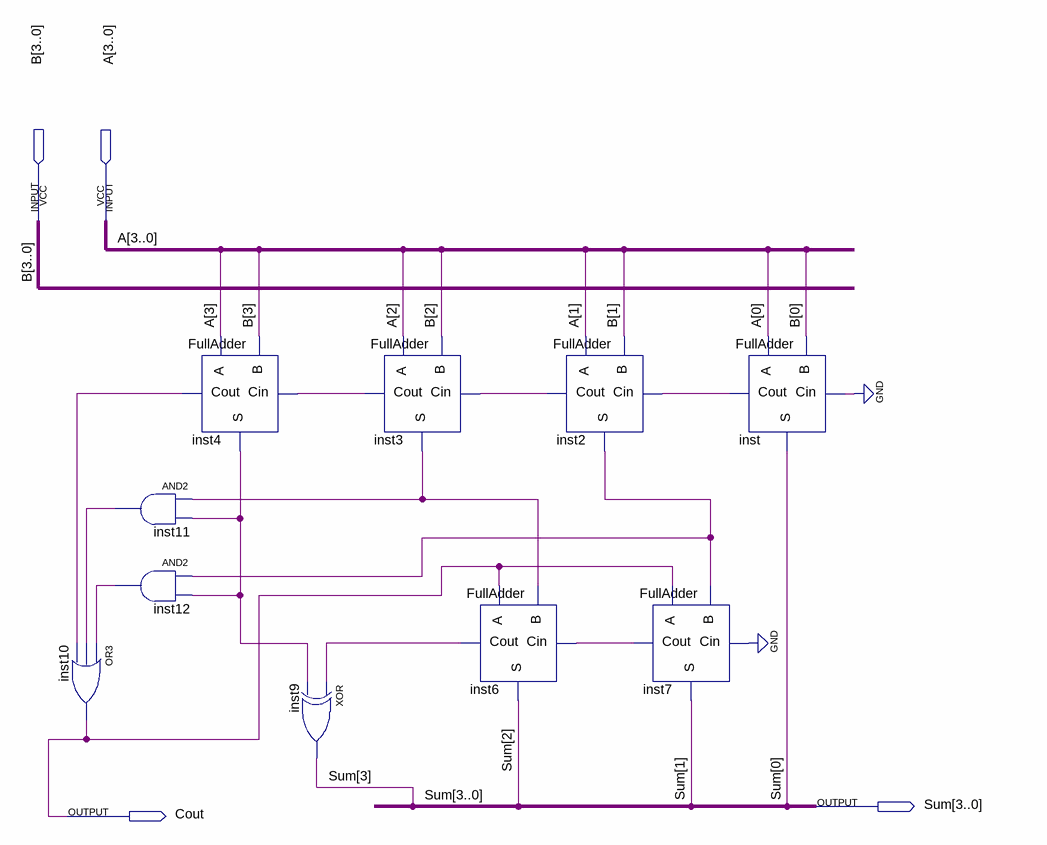
[diagram p0: schematic sheet]
// Quartus schematic BCD.bdf as structural Verilog: 10 symbols, 4 pins
module BCD (
  input  [3:0] B,
  input  [3:0] A,
  output [3:0] Sum,
  output Cout
);

  wire inst2_cout, inst2_s, inst3_cout, inst3_s, inst4_cout, inst4_s, inst6_cout, inst7_cout, inst11_out,
       inst12_out, inst_cout;

  or inst10 (Cout, inst12_out, inst11_out, inst4_cout);
  and inst11 (inst11_out, inst3_s, inst4_s);
  and inst12 (inst12_out, inst2_s, inst4_s);
  FullAdder inst4 (.A(A[3]), .B(B[3]), .Cin(inst3_cout), .S(inst4_s), .Cout(inst4_cout));
  xor inst9 (Sum[3], inst6_cout, inst4_s);
  FullAdder inst3 (.A(A[2]), .B(B[2]), .Cin(inst2_cout), .S(inst3_s), .Cout(inst3_cout));
  FullAdder inst6 (.A(Cout), .B(inst3_s), .Cin(inst7_cout), .S(Sum[2]), .Cout(inst6_cout));
  FullAdder inst2 (.A(A[1]), .B(B[1]), .Cin(inst_cout), .S(inst2_s), .Cout(inst2_cout));
  FullAdder inst7 (.A(Cout), .B(inst2_s), .Cin(1'b0), .S(Sum[1]), .Cout(inst7_cout));
  FullAdder inst (.A(A[0]), .B(B[0]), .Cin(1'b0), .S(Sum[0]), .Cout(inst_cout));
endmodule
